# EAGLE design SwitchedATXBreakout (EAGLE 7.2.0)
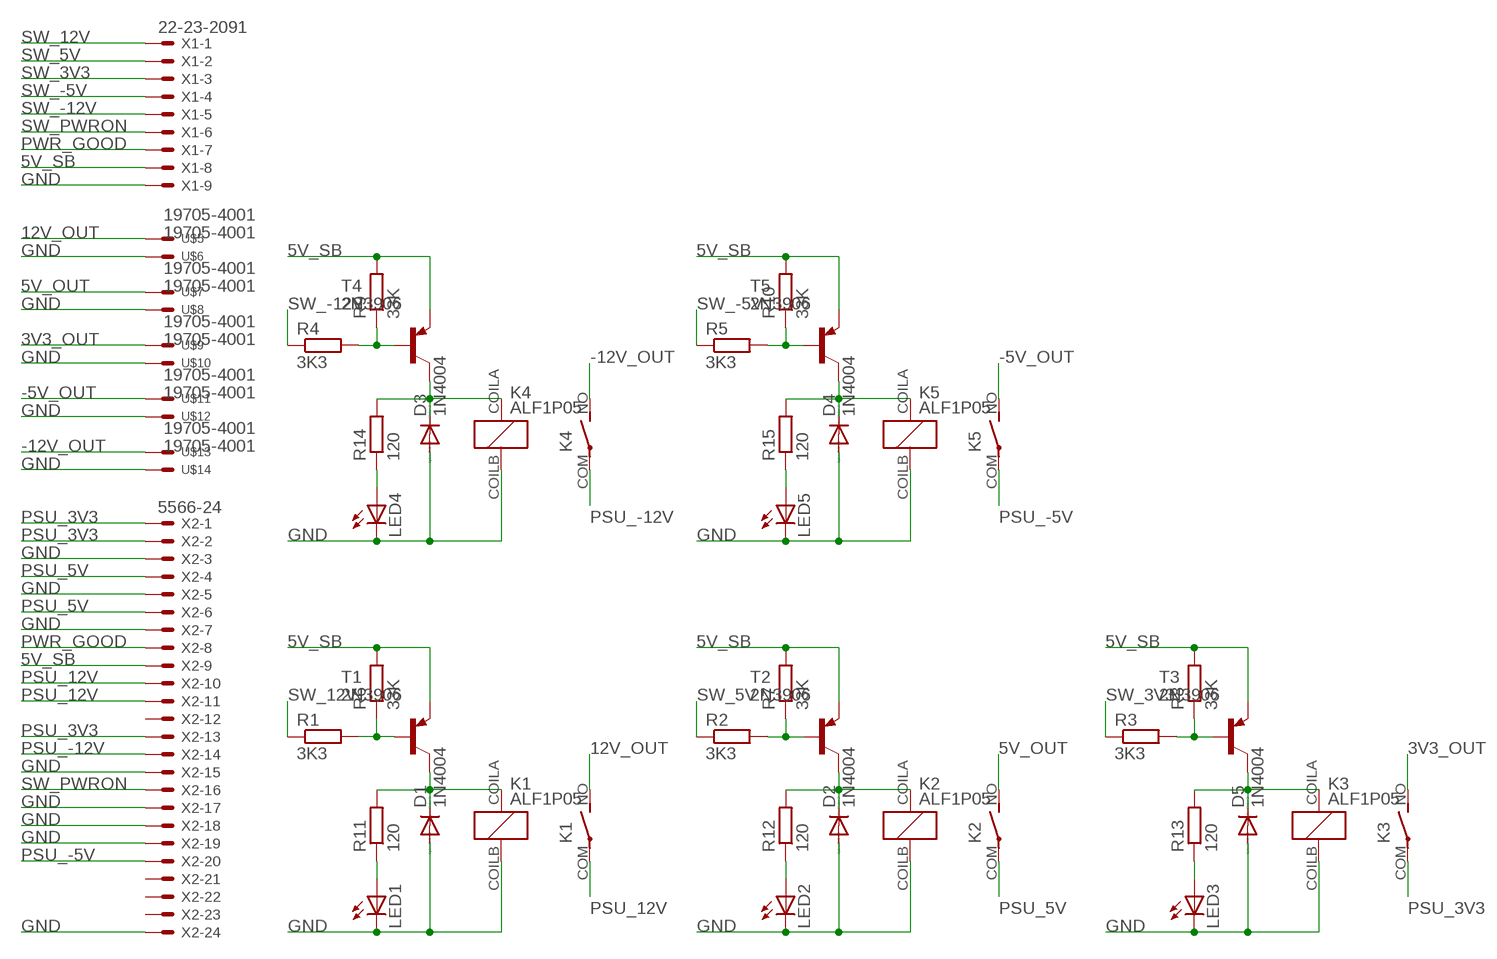
[diagram p0: schematic, sheet 1]

## Parts
D1  1N4004  [DO41-10]
D2  1N4004  [DO41-10]
D3  1N4004  [DO41-10]
D4  1N4004  [DO41-10]
D5  1N4004  [DO41-10]
K1  ALF1P05  [ALF]
K2  ALF1P05  [ALF]
K3  ALF1P05  [ALF]
K4  ALF1P05  [ALF]
K5  ALF1P05  [ALF]
LED1  LED3MM  [LED3MM]
LED2  LED3MM  [LED3MM]
LED3  LED3MM  [LED3MM]
LED4  LED3MM  [LED3MM]
LED5  LED3MM  [LED3MM]
R1  3K3  R-EU_0204/7  [0204/7]
R2  3K3  R-EU_0204/7  [0204/7]
R3  3K3  R-EU_0204/7  [0204/7]
R4  3K3  R-EU_0204/7  [0204/7]
R5  3K3  R-EU_0204/7  [0204/7]
R6  33K  R-EU_0204/7  [0204/7]
R7  33K  R-EU_0204/7  [0204/7]
R8  33K  R-EU_0204/7  [0204/7]
R9  33K  R-EU_0204/7  [0204/7]
R10  33K  R-EU_0204/7  [0204/7]
R11  120  R-EU_0204/7  [0204/7]
R12  120  R-EU_0204/7  [0204/7]
R13  120  R-EU_0204/7  [0204/7]
R14  120  R-EU_0204/7  [0204/7]
R15  120  R-EU_0204/7  [0204/7]
T1  2N3906  -PNP-TO92-EBC  [TO92-EBC]
T2  2N3906  -PNP-TO92-EBC  [TO92-EBC]
T3  2N3906  -PNP-TO92-EBC  [TO92-EBC]
T4  2N3906  -PNP-TO92-EBC  [TO92-EBC]
T5  2N3906  -PNP-TO92-EBC  [TO92-EBC]
U$5  19705-4001  [19705-4001]
U$6  19705-4001  [19705-4001]
U$7  19705-4001  [19705-4001]
U$8  19705-4001  [19705-4001]
U$9  19705-4001  [19705-4001]
U$10  19705-4001  [19705-4001]
U$11  19705-4001  [19705-4001]
U$12  19705-4001  [19705-4001]
U$13  19705-4001  [19705-4001]
U$14  19705-4001  [19705-4001]
X1  22-23-2091  [22-23-2091]
X2  5566-24  [5566-24]

## Nets
3V3_OUT [power-highcurrent]: K3.NO(1:S) U$9.P$1 U$9.P$2
5V_OUT [power-highcurrent]: K2.NO(1:S) U$7.P$1 U$7.P$2
5V_SB [power]: R6.2 R7.2 R8.2 R9.2 R10.2 T1.E T2.E T3.E T4.E T5.E X1.8 X2.9
12V_OUT [power-highcurrent]: K1.NO(1:S) U$5.P$1 U$5.P$2
-5V_OUT [power-highcurrent]: K5.NO(1:S) U$11.P$1 U$11.P$2
-12V_OUT [power-highcurrent]: K4.NO(1:S) U$13.P$1 U$13.P$2
GND [ground]: D1.A D2.A D3.A D4.A D5.A K1.COILB K2.COILB K3.COILB K4.COILB K5.COILB LED1.K(C) LED2.K(C) LED3.K(C) LED4.K(C) LED5.K(C) U$6.P$1 U$6.P$2 U$8.P$1 U$8.P$2 U$10.P$1 U$10.P$2 U$12.P$1 U$12.P$2 U$14.P$1 U$14.P$2 X1.9 X2.3 X2.5 X2.7 X2.15 X2.17 X2.18 X2.19 X2.24
N$1: R1.2 R6.1 T1.B
N$2: R4.2 R9.1 T4.B
N$3: D1.C K1.COILA R11.2 T1.C
N$4: D2.C K2.COILA R12.2 T2.C
N$5: R5.2 R10.1 T5.B
N$6: R2.2 R7.1 T2.B
N$7: R3.2 R8.1 T3.B
N$8: D3.C K4.COILA R14.2 T4.C
N$9: LED1.A R11.1
N$10: LED2.A R12.1
N$11: D4.C K5.COILA R15.2 T5.C
N$12: LED3.A R13.1
N$13: LED5.A R15.1
N$14: D5.C K3.COILA R13.2 T3.C
N$15: LED4.A R14.1
PSU_3V3 [power-highcurrent]: K3.COM(1:P) X2.1 X2.2 X2.13
PSU_5V [power-highcurrent]: K2.COM(1:P) X2.4 X2.6
PSU_12V [power-highcurrent]: K1.COM(1:P) X2.10 X2.11
PSU_-5V [power-highcurrent]: K5.COM(1:P) X2.20
PSU_-12V [power-highcurrent]: K4.COM(1:P) X2.14
PWR_GOOD: X1.7 X2.8
SW_3V3: R3.1 X1.3
SW_5V: R2.1 X1.2
SW_12V: R1.1 X1.1
SW_-5V: R5.1 X1.4
SW_-12V: R4.1 X1.5
SW_PWRON: X1.6 X2.16
Unconnected: X2.12 X2.21 X2.22 X2.23

## Library data of the parts
D1-D5 = diode:1N4004: DIODE general purpose rectifier, 1 A
K1-K5 = panasonic_alf_relay:ALF1P05: Power relay Source: http://www.mouser.com/ds/2/316/alf-catalog-461593.pdf
LED1-LED5 = led:LED: LED OSRAM: - CHIPLED LG R971, LG N971, LY N971, LG Q971, LY Q971, LO R971, LY R971 LH N974, LH R974 LS Q976, LO Q976, LY Q976 LO Q996 - Hyper CHIPLED LW Q18S LB Q993, LB Q99A, LB R99A - SideLED LS A670, LO A670, LY A670, LG A670, LP A670 LB A673, LV A673, LT A673, LW A673 LH A674 LY A675 LS A676, LA A676, LO A676, LY A676, LW A676 LS A679, LY A679, LG A679 - Hyper Micro SIDELED® LS Y876, LA Y876, LO Y876, LY Y876 LT Y87S - SmartLED LW L88C, LW L88S LB L89C, LB L89S, LG L890 LS L89K, LO L89K, LY L89K LS L896, LA L896, LO L896, LY L896 - TOPLED LS T670, LO T670, LY T670, LG T670, LP T670 LSG T670, LSP T670, LSY T670, LOP T670, LYG T670 LG T671, LOG T671, LSG T671 LB T673, LV T673, LT T673, LW T673 LH T674 LS T676, LA T676, LO T676, LY T676, LB T676, LH T676, LSB T676, LW T676 LB T67C, LV T67C, LT T67C, LS T67K, LO T67K, LY T67K, LW E67C LS E67B, LA E67B, LO E67B, LY E67B, LB E67C, LV E67C, LT E67C LW T67C LS T679, LY T679, LG T679 LS T770, LO T770, LY T770, LG T770, LP T770 LB T773, LV T773, LT T773, LW T773 LH T774 LS E675, LA E675, LY E675, LS T675 LS T776, LA T776, LO T776, LY T776, LB T776 LHGB T686 LT T68C, LB T68C - Hyper Mini TOPLED® LB M676 - Mini TOPLED Santana® LG M470 LS M47K, LO M47K, LY M47K Source: http://www.osram.convergy.de LUXEON: - LUMILED® LXK2-PW12-R00, LXK2-PW12-S00, LXK2-PW14-U00, LXK2-PW14-V00 LXK2-PM12-R00, LXK2-PM12-S00, LXK2-PM14-U00 LXK2-PE12-Q00, LXK2-PE12-R00, LXK2-PE12-S00, LXK2-PE14-T00, LXK2-PE14-U00 LXK2-PB12-K00, LXK2-PB12-L00, LXK2-PB12-M00, LXK2-PB14-N00, LXK2-PB14-P00, LXK2-PB14-Q00 LXK2-PR12-L00, LXK2-PR12-M00, LXK2-PR14-Q00, LXK2-PR14-R00 LXK2-PD12-Q00, LXK2-PD12-R00, LXK2-PD12-S00 LXK2-PH12-R00, LXK2-PH12-S00 LXK2-PL12-P00, LXK2-PL12-Q00, LXK2-PL12-R00 Source: www.luxeon.com KINGBRIGHT: KA-3528ASYC Source: www.kingbright.com
R1-R15 = resistor:R-EU_: RESISTOR, European symbol
T1-T5 = transistor-neu-to92:*-PNP-: PNP Transistror
U$5-U$14 = con-molex-additional:19705-4001: Molex 19705-4001 Solder pin disconnect.
X1 = con-molex:22-23-2091: .100" (2.54mm) Center Header - 9 Pin; MF: MOLEX; MPN: 22-23-2091; OC_FARNELL: 1756827; OC_NEWARK: 56H0450
X2 = con-molex:5566-24: Mini FIT connector 24 pol Source: http://www.molex.com; OC_FARNELL: unknown; OC_NEWARK: unknown

## Net classes
2 power-highcurrent: clearance 0.5 mm
3 ground: clearance 0.5 mm

## Board
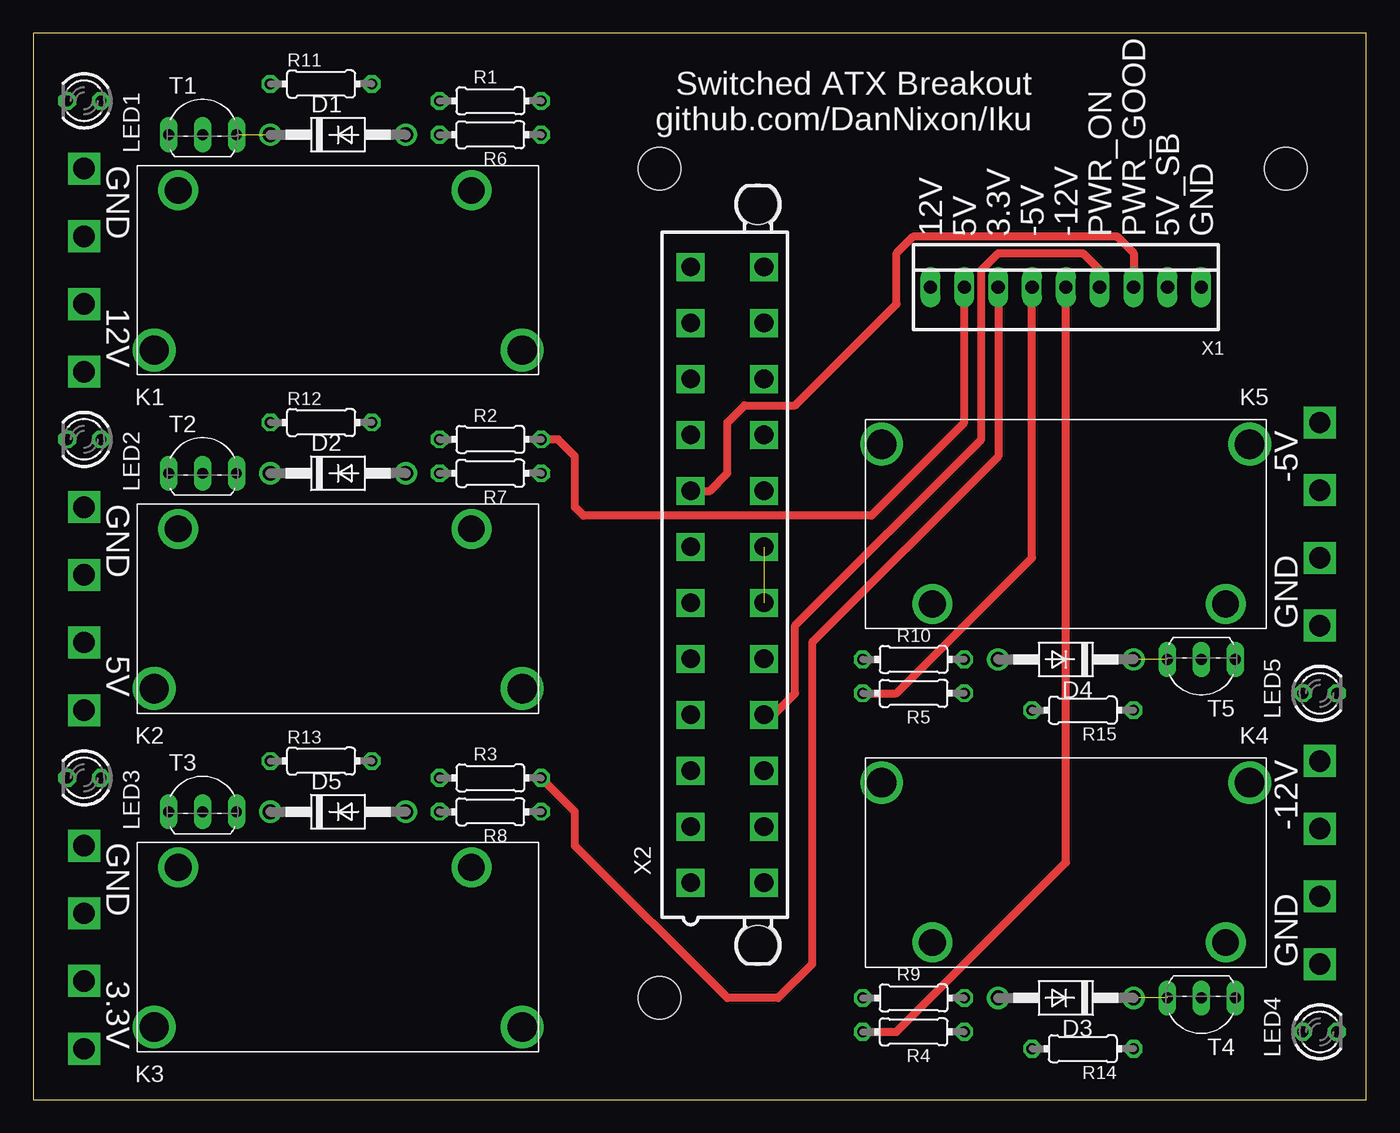
[diagram p1: board, top side]
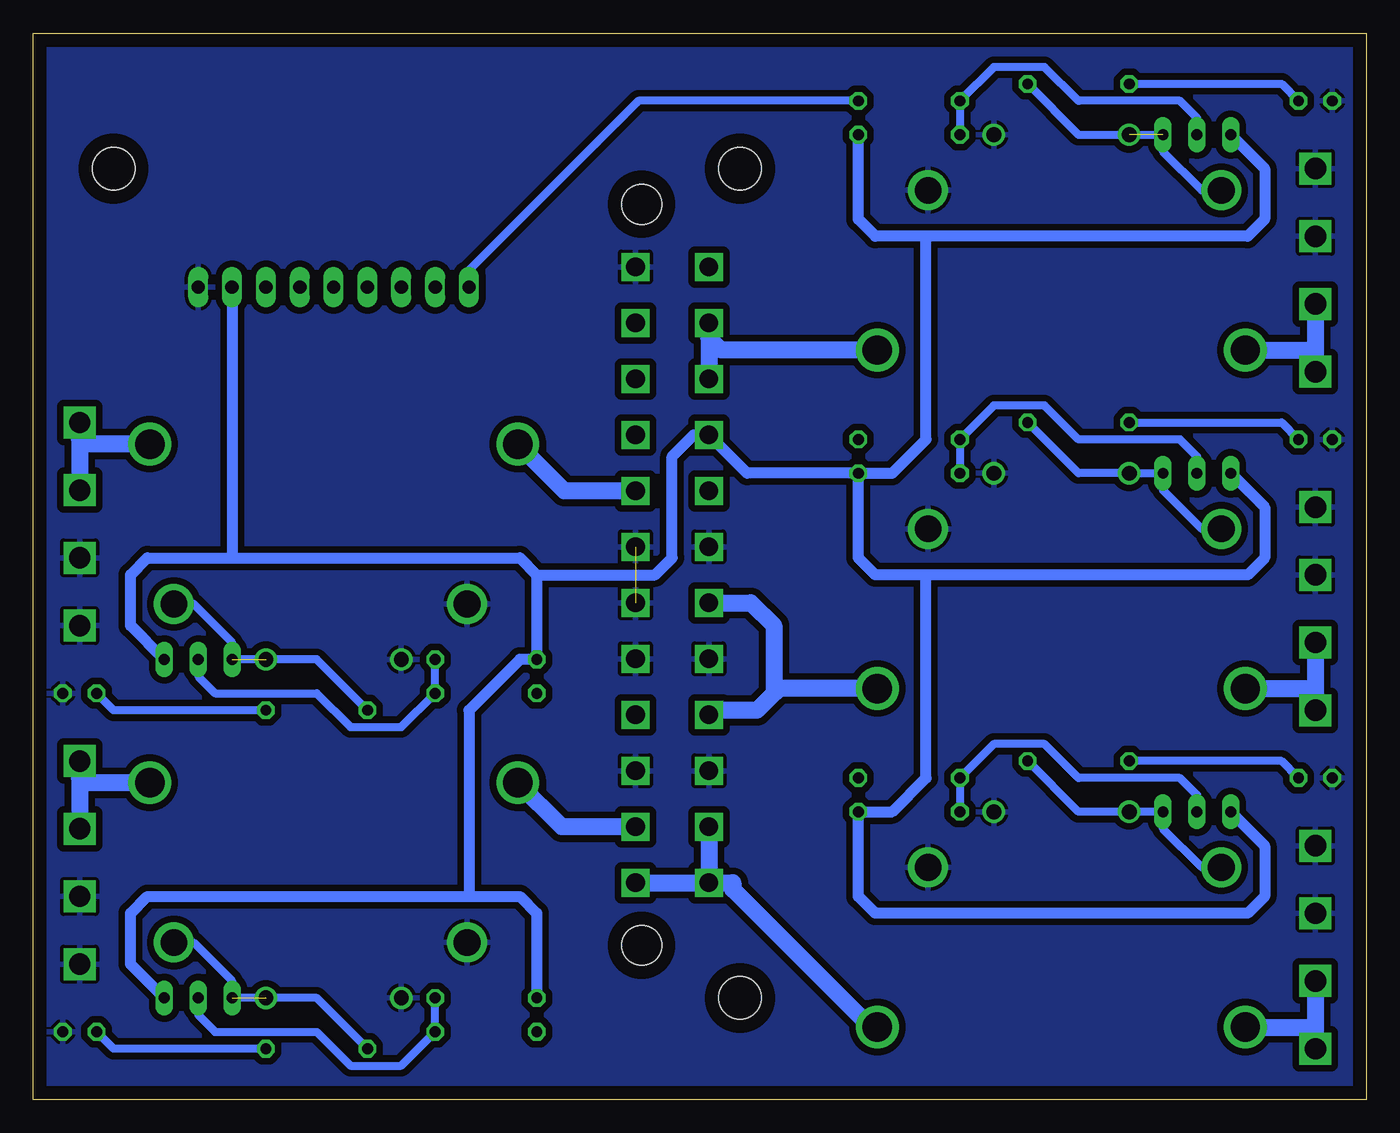
[diagram p2: board, bottom side, seen from below]

Size 100 x 80 mm. Coordinates in mm from the lower left corner, seen from the top.
Outline: 0,0 100,0 100,80 0,80 0,0
Copper layers (1*16): Top 0.035mm / dielectric 1.5mm / Bottom 0.035mm
Design rules "default": minimum track width 10mil, minimum drill 24mil, track to track 8mil, track to pad 8mil, pad to pad 8mil, via to via 8mil, smd to smd 8mil, copper to edge 40mil, drill to drill 8mil, minimum pad ring 10mil, minimum via ring 8mil, stop-mask expansion 4mil, vias tented up to drill 0mil, thermal gap 10mil
Holes 3.2 mm at 46.99,69.85 46.99,7.62 93.98,69.85

### Footprints (pad centres in the part's own frame; a part is rotated, then mirrored left to right if it is on the bottom)
DO41-10 = drill 1.118: A 5.08,0; C -5.08,0
ALF = drill 2: COILA -11.989,5.994; COILB 10.008,5.994 | drill 2.2: COM 13.818,-5.994; NO -13.792,-5.994
LED3MM = drill 0.813 octagon: A -1.27,0; K 1.27,0
0204/7 = drill 0.813 octagon: 1 -3.81,0; 2 3.81,0
TO92-EBC = drill 0.813 long: B 0,-1.27; C 2.54,-1.27; E -2.54,-1.27
19705-4001 = drill 1.6 square: P$1 -2.54,0; P$2 2.54,0
22-23-2091 = drill 1 long: 1 -10.16,0; 2 -7.62,0; 3 -5.08,0; 4 -2.54,0; 5 0,0; 6 2.54,0; 7 5.08,0; 8 7.62,0; 9 10.16,0
5566-24 = drill 1.4 square: 1 23.1,-2.75; 2 18.9,-2.75; 3 14.7,-2.75; 4 10.5,-2.75; 5 6.3,-2.75; 6 2.1,-2.75; 7 -2.1,-2.75; 8 -6.3,-2.75; 9 -10.5,-2.75; 10 -14.7,-2.75; 11 -18.9,-2.75; 12 -23.1,-2.75; 13 23.1,2.75; 14 18.9,2.75; 15 14.7,2.75; 16 10.5,2.75; 17 6.3,2.75; 18 2.1,2.75; 19 -2.1,2.75; 20 -6.3,2.75; 21 -10.5,2.75; 22 -14.7,2.75; 23 -18.9,2.75; 24 -23.1,2.75 | hole 3: 27.8,2.29; -27.8,2.29

### Placement (x,y rotation side)
D1  22.86,72.39 0 top
D2  22.86,46.99 0 top
D3  77.47,7.62 180 top
D4  77.47,33.02 180 top
D5  22.86,21.59 0 top
K1  22.86,62.23 0 top
K2  22.86,36.83 0 top
K3  22.86,11.43 0 top
K4  77.47,17.78 180 top
K5  77.47,43.18 180 top
LED1  3.81,74.93 180 top
LED2  3.81,49.53 180 top
LED3  3.81,24.13 180 top
LED4  96.52,5.08 0 top
LED5  96.52,30.48 0 top
R1  34.29,74.93 180 top
R2  34.29,49.53 180 top
R3  34.29,24.13 180 top
R4  66.04,5.08 0 top
R5  66.04,30.48 0 top
R6  34.29,72.39 0 top
R7  34.29,46.99 0 top
R8  34.29,21.59 0 top
R9  66.04,7.62 180 top
R10  66.04,33.02 180 top
R11  21.59,76.2 0 top
R12  21.59,50.8 0 top
R13  21.59,25.4 0 top
R14  78.74,3.81 180 top
R15  78.74,29.21 180 top
T1  12.7,73.66 0 top
T2  12.7,48.26 0 top
T3  12.7,22.86 0 top
T4  87.63,6.35 180 top
T5  87.63,31.75 180 top
U$5  3.81,57.15 90 top
U$6  3.81,41.91 90 top
U$7  3.81,31.75 90 top
U$8  3.81,67.31 90 top
U$9  3.81,6.35 90 top
U$10  96.52,38.1 90 top
U$11  96.52,48.26 90 top
U$12  96.52,12.7 90 top
U$13  96.52,22.86 90 top
U$14  3.81,16.51 90 top
X1  77.47,60.96 0 top
X2  52.07,39.37 270 top

### Tracks (layer width: path | path; a pad name or v marks a point on that pad's centre or on a via)
3V3_OUT
  Bottom 1.27: U$9.P$2 3.81,5.08 | 3.81,5.08 U$9.P$1 | K3.NO 4.17,5.44 3.81,5.08
5V_OUT
  Bottom 1.27: U$7.P$2 3.81,30.48 | 3.81,30.48 U$7.P$1 | 3.81,30.48 4.17,30.84 K2.NO
5V_SB
  Bottom 0.813: R7.2 46.44,46.99 X2.9 50.46,49.87 52.07,48.26 52.07,40.64 53.34,39.37 62.23,39.37 | T1.E 7.62,69.85 7.62,66.04 8.89,64.77 33.02,64.77 | 33.02,64.77 36.83,64.77 38.1,66.04 R6.2 | T3.E 7.62,19.05 7.62,15.24 8.89,13.97 36.83,13.97 38.1,15.24 R8.2 35.56,21.59 33.02,24.13 33.02,39.37 | R7.2 35.56,46.99 33.02,49.53 33.02,64.77 | T2.E 7.62,44.45 7.62,40.64 8.89,39.37 33.02,39.37 | 33.02,39.37 36.83,39.37 38.1,40.64 R7.2 | T5.E 92.71,35.56 92.71,39.37 91.44,40.64 85.09,40.64 | 85.09,40.64 63.5,40.64 62.23,39.37 | T4.E 92.71,10.16 92.71,13.97 91.44,15.24 67.31,15.24 | 67.31,15.24 63.5,15.24 62.23,13.97 R9.2 | 62.23,39.37 R10.2 63.5,33.02 67.31,29.21 67.31,15.24 | X1.8 85.09,40.64
12V_OUT
  Bottom 1.27: U$5.P$2 3.81,55.88 | 3.81,55.88 U$5.P$1 | 3.81,55.88 4.17,56.24 K1.NO
-5V_OUT
  Bottom 1.27: U$11.P$2 96.52,49.53 | 96.52,49.53 U$11.P$1 | 96.52,49.53 96.16,49.17 K5.NO
-12V_OUT
  Bottom 1.27: U$13.P$2 96.52,24.13 | 96.52,24.13 U$13.P$1 | 96.52,24.13 96.16,23.77 K4.NO
GND  (1 unrouted)
  pour Bottom: 0,80.01 100.33,80.01 100.33,0 0,0
N$1
  Bottom 0.61: T1.B 12.7,73.66 13.97,74.93 21.59,74.93 24.13,77.47 27.94,77.47 R1.2 R6.1
N$2
  Bottom 0.61: R9.1 R4.2 72.39,2.54 76.2,2.54 78.74,5.08 86.36,5.08 87.63,6.35 T4.B
N$3  (1 unrouted)
  Bottom 0.61: K1.COILA 12.34,68.22 15.24,71.12 T1.C 21.59,72.39 R11.2
N$4
  Bottom 0.61: K2.COILA 12.34,42.82 15.24,45.72 T2.C D2.C 21.59,46.99 R12.2
N$5
  Bottom 0.61: R10.1 R5.2 72.39,27.94 76.2,27.94 78.74,30.48 86.36,30.48 87.63,31.75 T5.B
N$6
  Bottom 0.61: T2.B 12.7,48.26 13.97,49.53 21.59,49.53 24.13,52.07 27.94,52.07 R2.2 R7.1
N$7
  Bottom 0.61: R8.1 R3.2 27.94,26.67 24.13,26.67 21.59,24.13 13.97,24.13 12.7,22.86 T3.B
N$8  (1 unrouted)
  Bottom 0.61: K4.COILA 87.99,11.79 85.09,8.89 T4.C 78.74,7.62 R14.2
N$9
  Bottom 0.61: R11.1 6.35,76.2 LED1.A
N$10
  Bottom 0.61: R12.1 6.35,50.8 LED2.A
N$11  (1 unrouted)
  Bottom 0.61: K5.COILA 87.99,37.19 85.09,34.29 T5.C 78.74,33.02 R15.2
N$12
  Bottom 0.61: LED3.A 6.35,25.4 R13.1
N$13
  Bottom 0.61: R15.1 93.98,29.21 LED5.A
N$14
  Bottom 0.61: K3.COILA 12.34,17.42 15.24,20.32 T3.C D5.C 21.59,21.59 R13.2
N$15
  Bottom 0.61: R14.1 93.98,3.81 LED4.A
PSU_3V3
  Bottom 1.27: X2.2 X2.1 | X2.13 X2.1 | X2.1 47.51,16.27 47.51,15.76 36.83,5.08 36.83,5.28 K3.COM
PSU_5V
  Bottom 1.27: X2.6 46.16,37.27 44.45,35.56 44.45,30.48 | 44.45,30.48 45.72,29.21 48.98,29.21 X2.4 | K2.COM 44.09,30.84 44.45,30.48
PSU_12V
  Bottom 1.27: X2.11 49.32,57.15 | 49.32,57.15 X2.10 | K1.COM 48.41,56.24 49.32,57.15
PSU_-5V
  Bottom 1.27: X2.20 60.15,45.67 K5.COM
PSU_-12V
  Bottom 1.27: X2.14 60.35,20.47 K4.COM
PWR_GOOD
  Top 0.61: X2.8 50.75,45.67 52.07,46.99 52.07,50.8 53.34,52.07 57.15,52.07 64.77,59.69 64.77,63.5 66.04,64.77 81.28,64.77 82.55,63.5 X1.7
SW_3V3
  Top 0.61: X1.3 72.39,48.26 58.42,34.29 58.42,10.16 55.88,7.62 52.07,7.62 40.64,19.05 40.64,21.59 R3.1
SW_5V
  Top 0.61: X1.2 69.85,50.8 62.87,43.81 41.27,43.81 40.64,44.45 40.64,48.26 39.37,49.53 R2.1
SW_12V
  Bottom 0.61: R1.1 54.61,74.93 67.31,62.23 X1.1
SW_-5V
  Top 0.61: R5.1 64.77,30.48 74.93,40.64 X1.4
SW_-12V
  Top 0.61: R4.1 64.77,5.08 77.47,17.78 X1.5
SW_PWRON
  Top 0.61: X2.16 55.54,28.87 57.15,30.48 57.15,35.56 71.12,49.53 71.12,62.23 72.39,63.5 78.74,63.5 80.01,62.23 X1.6

### Text on the board
tNames: Switched ATX Breakout / github.com/DanNixon/Iku | GND | 12V | 5V | 3.3V | -5V | -12V | PWR_ON | PWR_GOOD | 5V_SB | GND | 12V | -5V | GND | GND | 5V | -12V | GND | GND | 3.3V